# EasyEDA Pro project ProDocument_PCB_2024-01-04.epro

# Board PCB
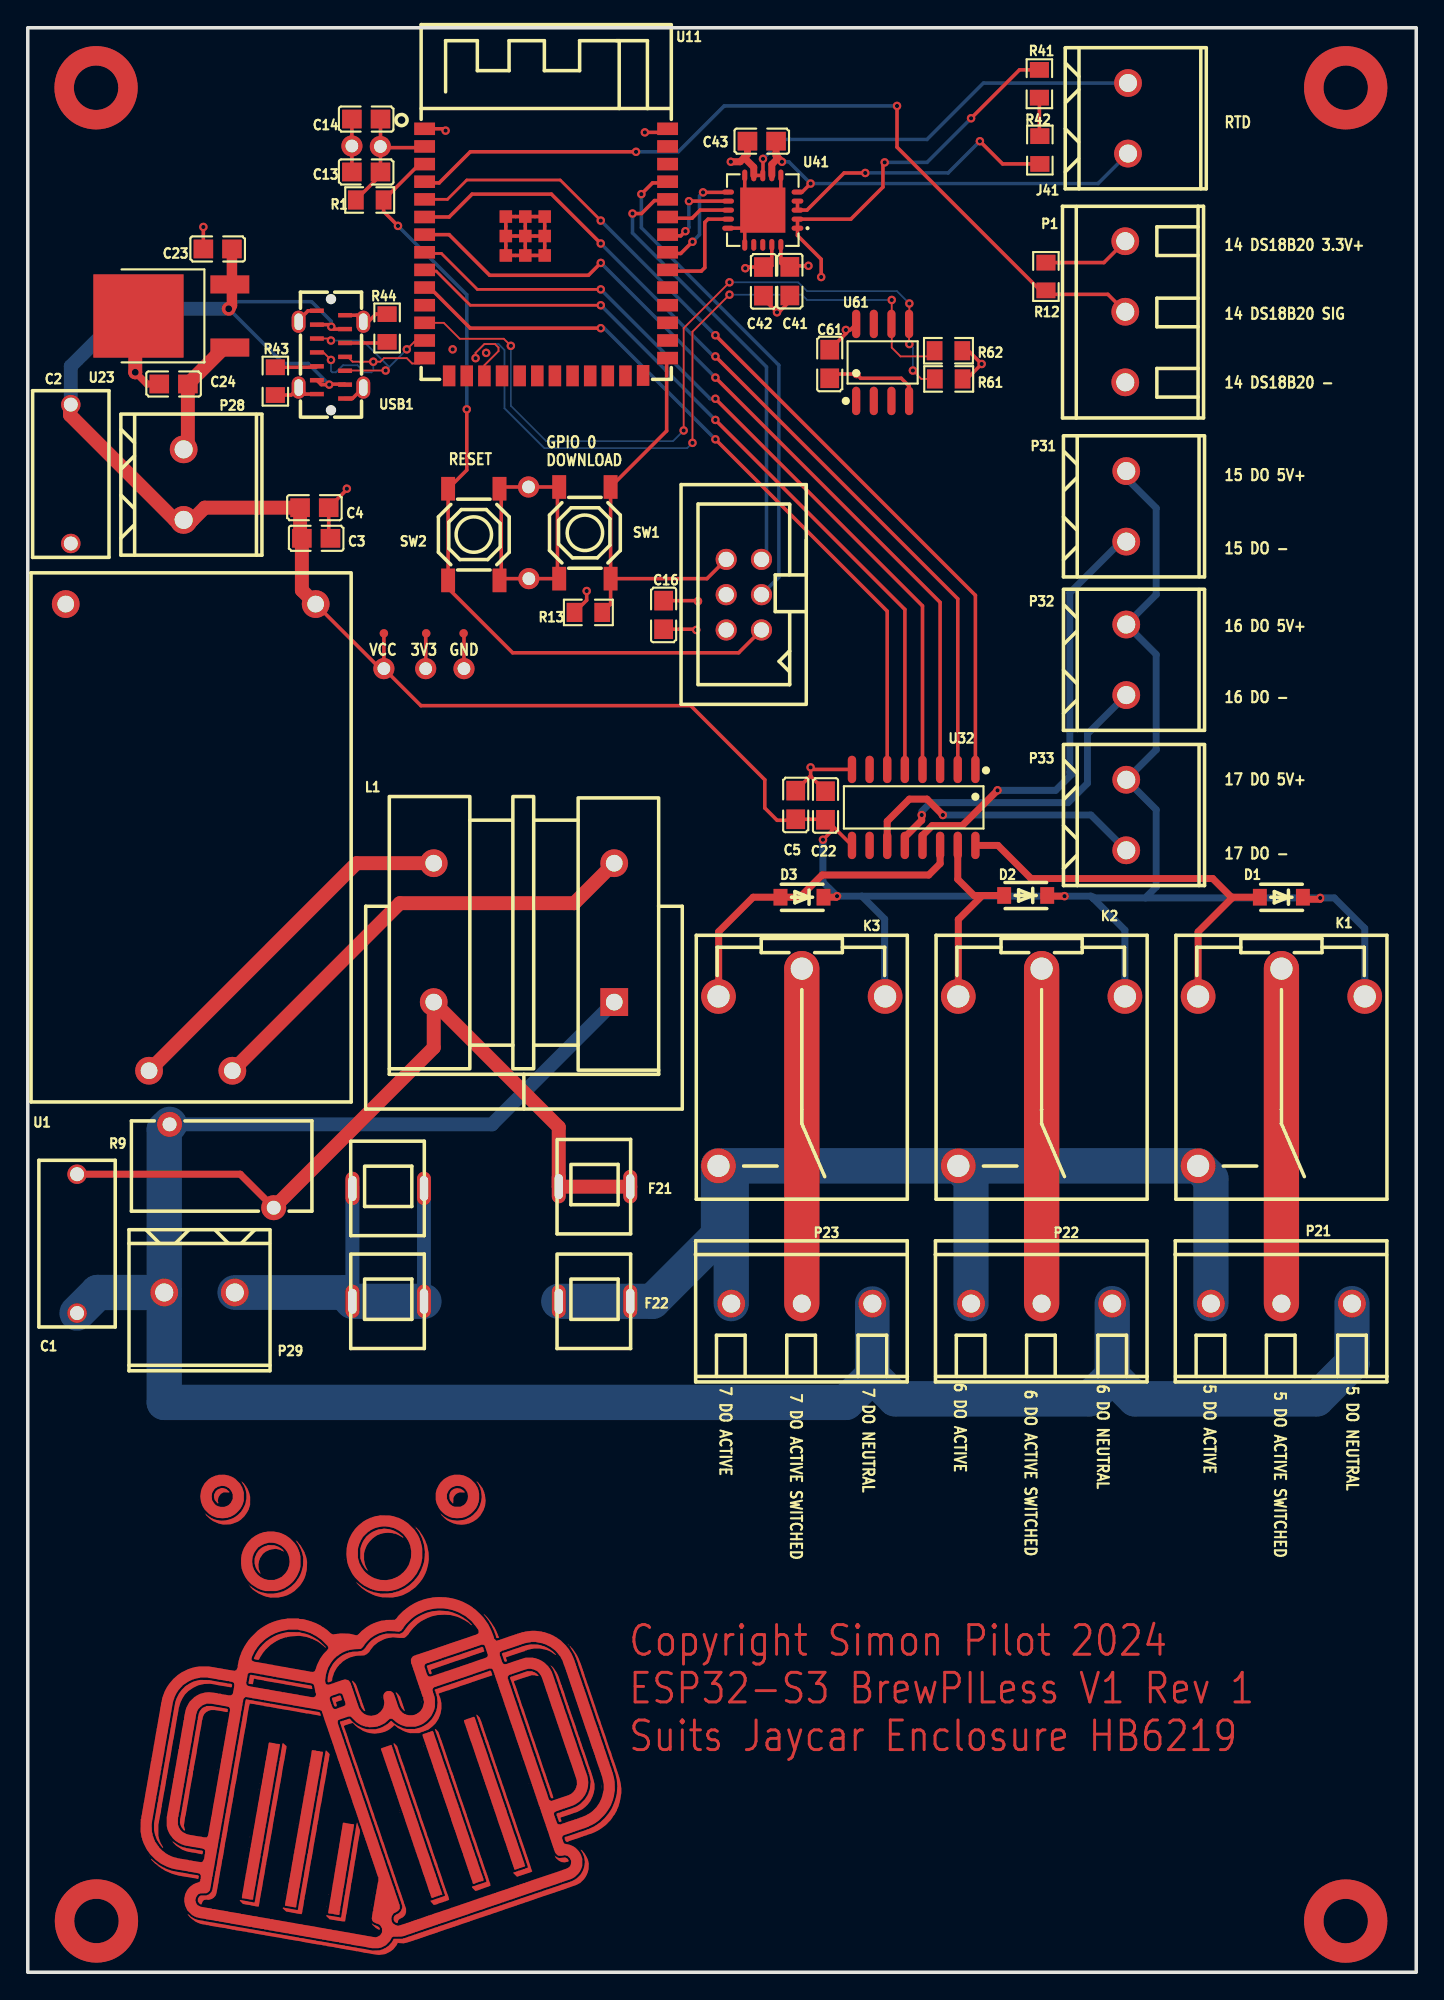
[diagram p0: board, top side]
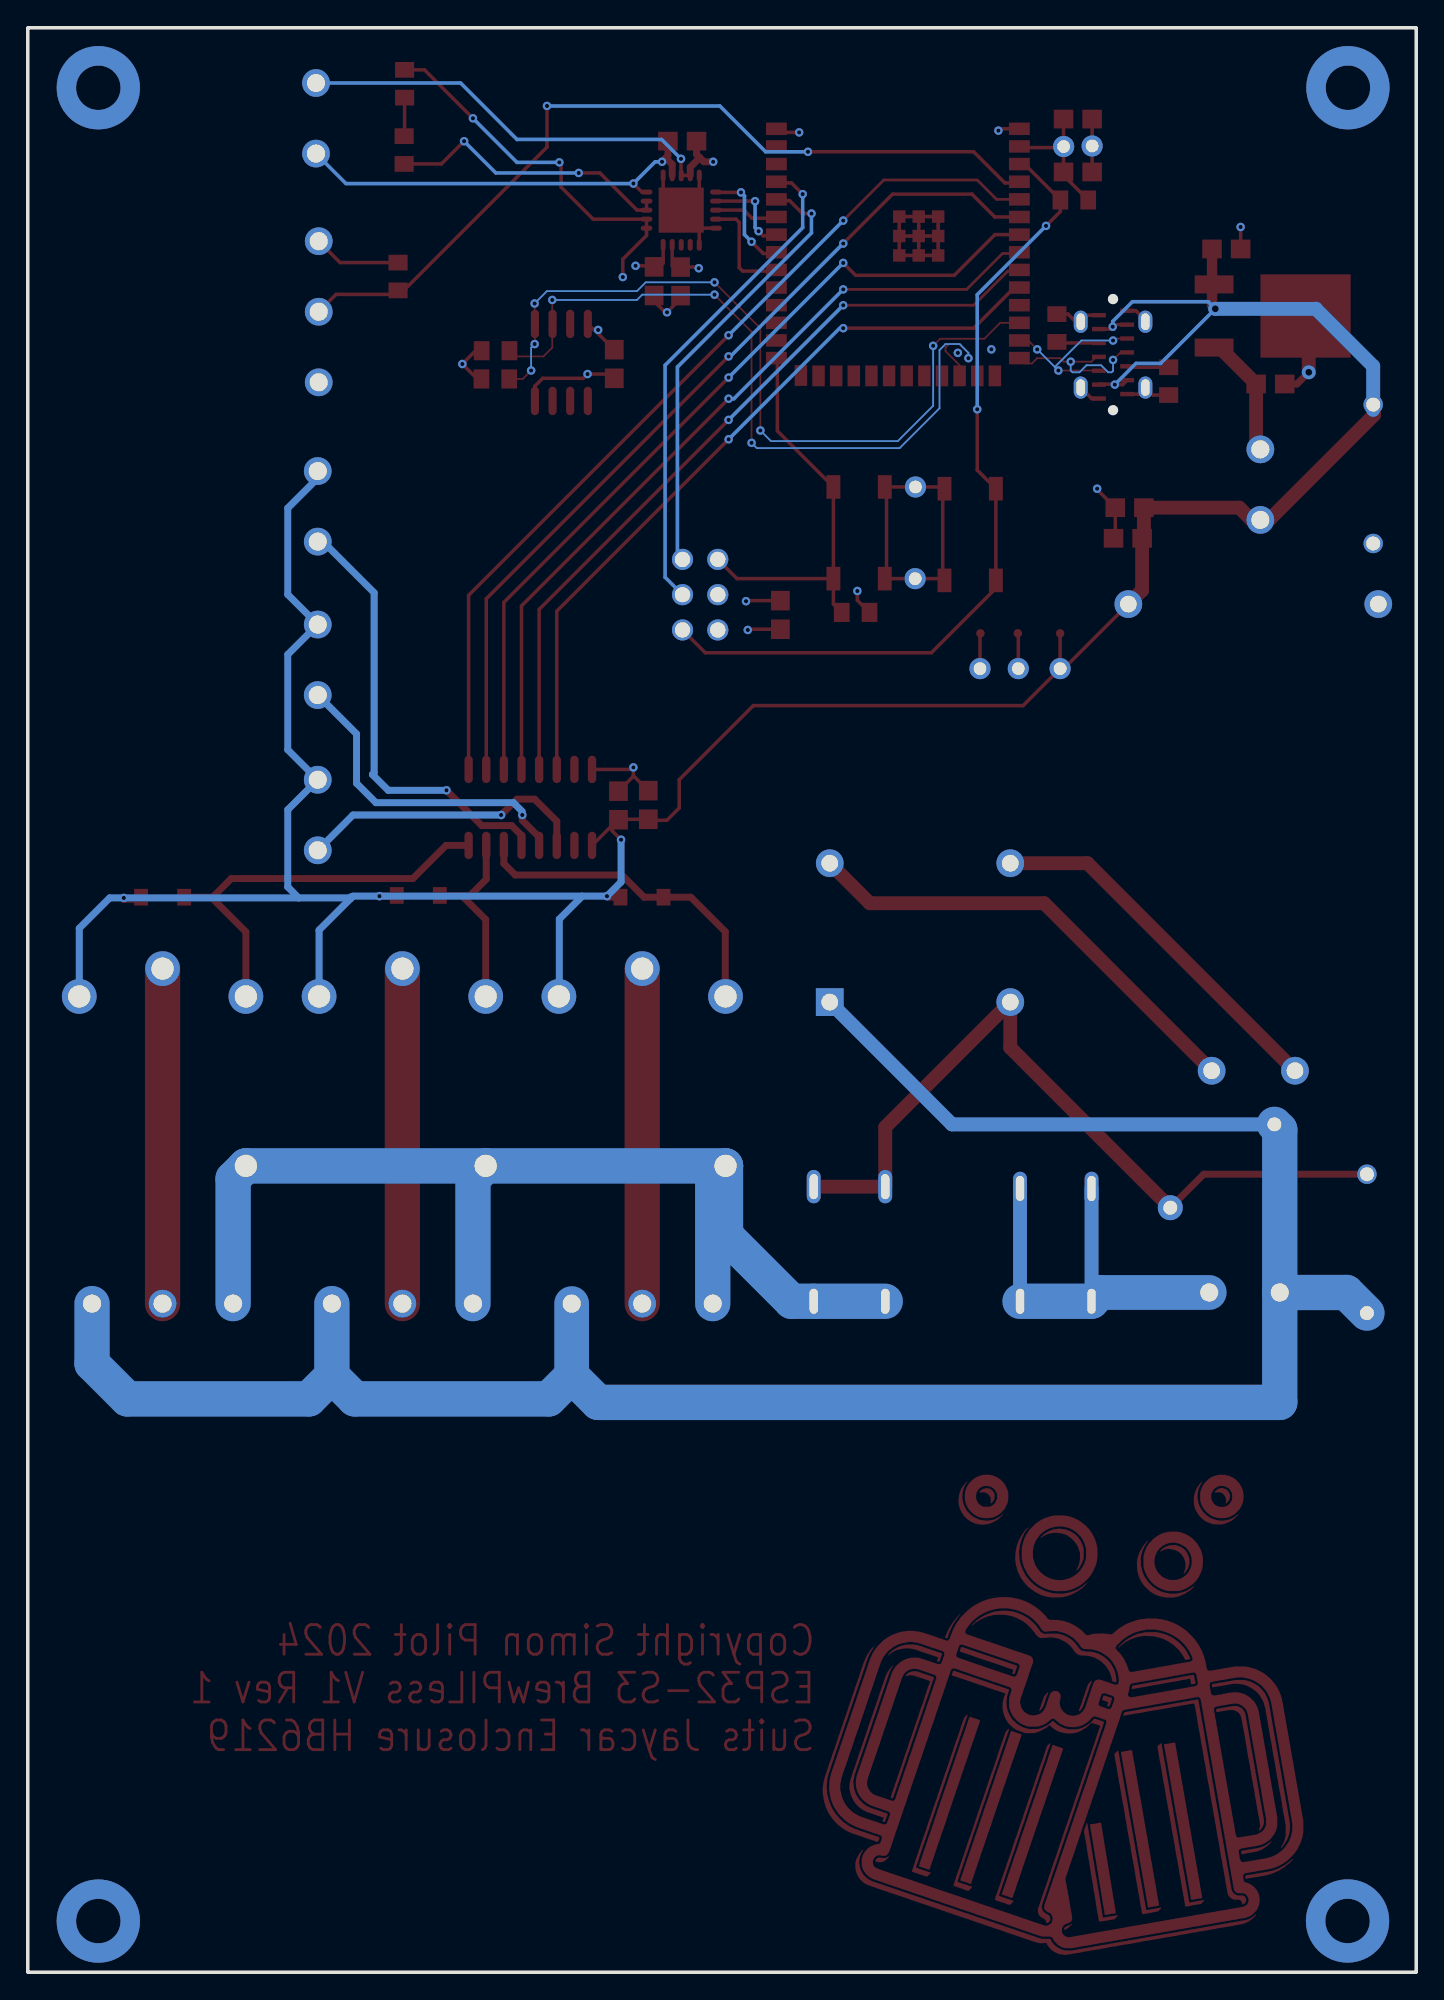
[diagram p1: board, bottom side, seen from below]

Outline 100 x 140 mm; copper layers: Top Layer, GND, 3V3, Bottom Layer. Coordinates in mm from the lower left corner of the outline.
Outline path: rectangle 100,140 0,0
Stack: Top Layer 0.035mm 外层铜厚1oz / Dielectric1 0.2104mm 7628 RC49% 8.6mil / GND 0.0152mm 内层铜厚 / Dielectric2 1.065mm 1.1mm H/HOZ 含铜 / 3V3 0.0152mm 内层铜厚 / Dielectric3 0.2104mm 7628 RC49% 8.6mil / Bottom Layer 0.035mm 外层铜厚1oz

## Design rules (mm)
net U27_USBD+: DP1
net U27_USBD-: DP1
net U11_IO39: U11_SPI
net U11_IO40: U11_SPI
net U11_IO8: U11_I2C
net U11_IO9: U11_I2C
template: User Custom Config
spacing safeClearance (default): track to track 0.152, other pairs 0.152 to 0.3
track width trackWidth (default): min 0.127, default 0.254, max 2.54
differential pair differentialPair (default): width min 0.127, default 0.254, max 2.54; gap min 0.152, default 0.152
via viaSize (default): diameter min 0.5, default 0.61, max 10; hole min 0.3, default 0.305, max 5.999
net VCC uses innerPlane1

## Placement (name value [footprint] x y rotation side)
C1  100nF  [CAP-TH_L12.0-W5.5-P10.00-D0.6]  3.55 52.46 90 top
C2  100nF  [CAP-TH_L12.0-W5.5-P10.00-D0.6]  3.1 107.87 90 top
C3  1uF  [C0805]  20.77 103.24 180 top
C4  10uF  [C0805]  20.64 105.45 180 top
C5  22uF  [C0805]  55.31 84.04 90 top
C13  100nF  [C0805]  24.37 129.62 180 top
C14  22uF  [C0805]  24.37 133.43 0 top
C16  100nF  [C0805]  45.79 97.73 90 top
C22  100nF  [C0805]  57.45 84.01 90 top
C23  10uF  [C0805]  13.68 124.07 0 top
C24  10uF  [C0805]  10.5 114.35 180 top
C41  100nF  [C0805]  54.89 121.76 90 top
C42  100nF  [C0805]  52.98 121.74 90 top
C43  100nF  [C0805]  52.86 131.84 0 top
C61  100nF  [C0805]  57.76 115.79 90 top
D1  SM4007PL  [SOD-123F_L2.8-W1.8-LS3.7-RD]  90.29 77.4 180 top
D2  SM4007PL  [SOD-123F_L2.8-W1.8-LS3.7-RD]  71.87 77.53 180 top
D3  SM4007PL  [SOD-123F_L2.8-W1.8-LS3.7-RD]  55.76 77.4 180 top
F21  -  [FUSE-TH_5X20RHOSFUSECLIP-SEAT]  40.82 56.56 0 top
F22  5A  [FUSE-TH_5X20RHOSFUSECLIP-SEAT]  40.82 48.31 0 top
F210  1A  [FUSE-TH_5X20RHOSFUSECLIP-SEAT]  25.96 56.43 0 top
F220  10A  [FUSE-TH_5X20RHOSFUSECLIP-SEAT]  25.96 48.31 0 top
J5  PROG  [IDC-TH_6P-P2.54_C11214]  51.57 99.18 90 top
J41  WJ500V-5.08-2P  [CONN-TH_2P-P5.00_WJ500V-5.08-2P]  79.24 133.48 270 top
K1  -  [RELAY-TH_973-XXVDC-SL-A]  90.29 65.16 270 top
K2  -  [RELAY-TH_973-XXVDC-SL-A]  73.02 65.16 270 top
K3  -  [RELAY-TH_973-XXVDC-SL-A]  55.75 65.16 270 top
L1  -  [FILTER-TH_UU10.5Y-10MH]  35.74 74.85 0 top
NOREF  -  [Pad_e4629]  25.65 93.86 0 top
NOREF#2  -  [Pad_e4638]  28.66 93.86 0 top
NOREF#3  -  [Pad_e4712]  28.7 96.4 0 top
NOREF#4  -  [Pad_e4713]  31.39 96.4 0 top
NOREF#5  -  [Pad_e1184]  36.09 100.34 0 top
NOREF#6  -  [Pad_e1270]  25.39 131.45 0 top
NOREF#7  -  [Pad_e1266]  23.34 131.49 0 top
NOREF#8  -  [Pad_e1180]  36.07 106.94 0 top
NOREF#9  -  [Pad_e4640]  31.42 93.86 0 top
NOREF#10  -  [Pad_e4711]  25.65 96.4 0 top
P1  WJ500V-5.08-3P  [CONN-TH_3P-P5.00_WJ500V-5.08-3P]  79.05 119.55 270 top
P21  WJ500V-5.08-3P  [CONN-TH_3P-P5.00_WJ500V-5.08-3P]  90.29 48.14 180 top
P22  WJ500V-5.08-3P  [CONN-TH_3P-P5.00_WJ500V-5.08-3P]  73.02 48.14 180 top
P23  WJ500V-5.08-3P  [CONN-TH_3P-P5.00_WJ500V-5.08-3P]  55.75 48.14 180 top
P28  WJ500V-5.08-2P  [CONN-TH_2P-P5.00_WJ500V-5.08-2P]  11.23 107.11 270 top
P29  WJ500V-5.08-2P  [CONN-TH_2P-P5.00_WJ500V-5.08-2P]  12.37 48.94 180 top
P31  WJ500V-5.08-2P  [CONN-TH_2P-P5.00_WJ500V-5.08-2P]  79.11 105.54 270 top
P32  WJ500V-5.08-2P  [CONN-TH_2P-P5.00_WJ500V-5.08-2P]  79.11 94.49 270 top
P33  WJ500V-5.08-2P  [CONN-TH_2P-P5.00_WJ500V-5.08-2P]  79.11 83.32 270 top
R1  12kΩ  [R0805]  24.63 127.6 180 top
R9  10D561K  [RES-TH_L13.0-W6.0-P7.50-D0.9-S6.00]  13.96 58.05 0 top
R12  4.7kΩ  [R0805]  73.33 122.09 270 top
R13  12kΩ  [R0805]  40.37 97.91 180 top
R41  200Ω  [R0805]  72.86 135.97 270 top
R42  200Ω  [R0805]  72.89 131.2 90 top
R43  56kΩ  [R0805]  17.83 114.56 90 top
R44  56kΩ  [R0805]  25.88 118.38 90 top
R61  2.4kΩ  [R0805]  66.33 114.72 0 top
R62  2.4kΩ  [R0805]  66.31 116.75 0 top
SW1  TS-1187A-B-A-B  [SW-SMD_4P-L5.1-W5.1-P3.70-LS6.5-TL-2]  40.13 103.64 270 top
SW2  TS-1187A-B-A-B  [SW-SMD_4P-L5.1-W5.1-P3.70-LS6.5-TL-2]  32.12 103.51 90 top
U1  -  [PWRM-TH_HLK-5M05]  11.73 81.71 90 top
U11  2.4GHz  [WIRELM-SMD_ESP32-S3-WROOM-1]  37.33 123.83 0 top
U23  -  [TO-252-2_L6.6-W6.1-P4.57-LS9.9-TL-CW]  11.26 119.25 180 top
U32  -  [SOIC-16_L9.9-W3.9-P1.27-LS6.0-BL]  63.8 83.87 180 top
U41  MAX31865ATP+T  [QFN-20_L5.0-W5.0-P0.65-BL-EP]  52.94 126.87 90 top
U61  ATECC608A-SSHDA-T  [SOIC-8_L4.9-W3.9-P1.27-LS6.0-BL]  61.57 115.9 0 top
USB1  TYPE-C 14P LTH10.0  [TYPE-C-SMD_918-468K2029Y50001]  21.84 116.47 0 top

## Footprints (pads in the part's own frame, mm; a bottom-side part is the same pattern mirrored in y, then rotated)
C0805
  rect 1.41x1.35 smd: 1(-1.03,0) 2(1.03,0)
CAP-TH_L12.0-W5.5-P10.00-D0.6
  round 1.4 hole 1: 1(-5,0) 2(5,0)
CONN-TH_2P-P5.00_WJ500V-5.08-2P
  round 2 hole 1.3: 1(-2.54,0) 2(2.54,0)
CONN-TH_3P-P5.00_WJ500V-5.08-3P
  round 2 hole 1.3: 1(-5.08,0) 2(0,0) 3(5.08,0)
FILTER-TH_UU10.5Y-10MH
  rect 2x2 hole 1.2: 1(6.5,-5)
  round 2 hole 1.2: 2(6.5,5) 3(-6.5,5) 4(-6.5,-5)
FUSE-TH_5X20RHOSFUSECLIP-SEAT
  oval 1x2.4 hole 0.6x1.8: 1(-2.575,0)
  oval 1x2.4 hole 0.6x1.799: 1(2.575,0)
IDC-TH_6P-P2.54_C11214
  round 1.524 hole 1.1: 1(-2.54,-1.27) 2(-2.54,1.27) 3(0,-1.27) 4(0,1.27) 5(2.54,-1.27) 6(2.54,1.27)
Pad_e1180
  round 1.524 hole 0.914: 42(0,0)
Pad_e1184
  round 1.524 hole 0.914: 43(0,0)
Pad_e1266
  round 1.524 hole 0.914: 44(0,0)
Pad_e1270
  round 1.524 hole 0.914: 45(0,0)
Pad_e4629
  round 1.524 hole 0.914: 1(0,0)
Pad_e4638
  round 1.524 hole 0.914: 1(0,0)
Pad_e4640
  round 1.524 hole 0.914: 1(0,0)
Pad_e4711
  round 0.61 smd: TP1(0,0)
Pad_e4712
  round 0.61 smd: TP2(0,0)
Pad_e4713
  round 0.61 smd: TP3(0,0)
PWRM-TH_HLK-5M05
  round 2 hole 1.2: 1(-16.8,3) 2(-16.8,-3) 3(16.8,9) 4(16.8,-9)
QFN-20_L5.0-W5.0-P0.65-BL-EP
  oval 0.364x0.847 smd: 1(-1.3,-2.498) 2(-0.65,-2.498) 3(0,-2.498) 4(0.65,-2.498) 5(1.3,-2.498) 11(1.3,2.498) 12(0.65,2.498) 13(0,2.498) 14(-0.65,2.498) 15(-1.3,2.498)
  oval 0.847x0.364 smd: 6(2.498,-1.3) 7(2.498,-0.65) 8(2.498,0) 9(2.498,0.65) 10(2.498,1.3) 16(-2.498,1.3) 17(-2.498,0.65) 18(-2.498,0) 19(-2.498,-0.65) 20(-2.498,-1.3)
  rect 3.25x3.25 smd: 21(0,0)
R0805
  rect 1.133x1.377 smd: 1(-1,0) 2(1,0)
RELAY-TH_973-XXVDC-SL-A
  round 2.5 hole 1.6: 1(-5.1,-6) 2(7.1,-6) 4(-5.1,6) 5(-7.1,0)
RES-TH_L13.0-W6.0-P7.50-D0.9-S6.00
  round 1.8 hole 1: 1(-3.75,3) 2(3.75,-3)
SOD-123F_L2.8-W1.8-LS3.7-RD
  rect 1x1.2 smd: 1(-1.55,0) 2(1.55,0)
SOIC-8_L4.9-W3.9-P1.27-LS6.0-BL
  oval 0.588x2.045 smd: 1(-1.905,-2.772) 2(-0.635,-2.772) 3(0.635,-2.772) 4(1.905,-2.772) 5(1.905,2.772) 6(0.635,2.772) 7(-0.635,2.772) 8(-1.905,2.772)
SOIC-16_L9.9-W3.9-P1.27-LS6.0-BL
  oval 0.602x1.971 smd: 1(-4.445,-2.736) 2(-3.175,-2.736) 3(-1.905,-2.736) 4(-0.635,-2.736) 5(0.635,-2.736) 6(1.905,-2.736) 7(3.175,-2.736) 8(4.445,-2.736) 9(4.445,2.736) 10(3.175,2.736) 11(1.905,2.736) 12(0.635,2.736) 13(-0.635,2.736) 14(-1.905,2.736) 15(-3.175,2.736) 16(-4.445,2.736)
SW-SMD_4P-L5.1-W5.1-P3.70-LS6.5-TL-2
  rect 1.7x1 smd: 1(-3.3,1.85) 2(3.3,1.85) 3(-3.3,-1.85) 4(3.3,-1.85)
TO-252-2_L6.6-W6.1-P4.57-LS9.9-TL-CW
  rect 2.8x1.3 smd: 1(-3.292,2.273) 3(-3.292,-2.273)
  rect 6.5x6 smd: 2(3.292,0)
TYPE-C-SMD_918-468K2029Y50001
  oval 1x1.6 hole 0.6x1.2: 15(-2.33,2.37) 15(-2.33,-2.37) 15(2.33,2.37) 15(2.33,-2.37)
  rect 1x0.32 smd: A1(1.016,2.84) A4(1.016,1.84) A5(1.016,0.84) A6(1.016,-0.16) A7(1.016,-1.16) A9(1.016,-2.16) A12(1.016,-3.16) B1(-1.016,-2.84) B4(-1.016,-1.84) B5(-1.016,-0.84) B6(-1.016,0.16) B7(-1.016,1.16) B9(-1.016,2.16) B12(-1.016,3.16)
WIRELM-SMD_ESP32-S3-WROOM-1
  rect 1.5x0.9 smd: 1(-8.75,8.895) 2(-8.75,7.625) 3(-8.75,6.355) 4(-8.75,5.085) 5(-8.75,3.815) 6(-8.75,2.545) 7(-8.75,1.275) 8(-8.75,0.005) 9(-8.75,-1.265) 10(-8.75,-2.535) 11(-8.75,-3.805) 12(-8.75,-5.075) 13(-8.75,-6.345) 14(-8.75,-7.615) 27(8.75,-7.615) 28(8.75,-6.345) 29(8.75,-5.075) 30(8.75,-3.805) 31(8.75,-2.535) 32(8.75,-1.265) 33(8.75,0.005) 34(8.75,1.275) 35(8.75,2.545) 36(8.75,3.815) 37(8.75,5.085) 38(8.75,6.355) 39(8.75,7.625) 40(8.75,8.895)
  rect 0.9x1.5 smd: 15(-6.985,-8.895) 16(-5.715,-8.895) 17(-4.445,-8.895) 18(-3.175,-8.895) 19(-1.905,-8.895) 20(-0.635,-8.895) 21(0.635,-8.895) 22(1.905,-8.895) 23(3.175,-8.895) 24(4.445,-8.895) 25(5.715,-8.895) 26(6.985,-8.865)
  rect 0.9x0.9 smd: 41(-2.9,2.575) 41(-2.9,1.175) 41(-2.9,-0.225) 41(-1.5,2.575) 41(-1.5,1.175) 41(-1.5,-0.225) 41(-0.1,2.575) 41(-0.1,1.175) 41(-0.1,-0.225)

## Nets
3V3: C13.1 C14.2 C16.1 C24.2 C41.2 C42.2 C61.2 J5.2 NOREF#2.1 NOREF#3.TP2 NOREF#6.45 P1.1 R1.2 R12.1 R13.2 R61.2 R62.2 U11.2 U23.2 U41.19 U41.20 U61.8
GND: C2.1 C3.1 C4.1 C5.2 C13.2 C14.1 C16.2 C22.2 C23.1 C24.1 C41.1 C42.1 C61.1 J5.4 NOREF#4.TP3 NOREF#5.43 NOREF#7.44 NOREF#8.42 NOREF#9.1 P1.3 P28.1 R43.1 R44.2 SW1.3 SW1.4 SW2.3 SW2.4 U1.3 U11.1 U11.40 U11.41 U23.1 U32.8 U41.6 U41.10 U41.15 U41.16 U41.21 U61.4 USB1.15 USB1.A1 USB1.A12 USB1.B1 USB1.B12
VCC: C2.2 C3.2 C4.2 C5.1 C22.1 C23.2 D1.1 D2.1 D3.1 K1.4 K2.4 K3.4 NOREF.1 NOREF#10.TP1 P28.2 P31.1 P32.1 P33.1 U1.4 U23.3 U32.9 USB1.A4 USB1.A9 USB1.B4 USB1.B9
RLY1_OUT: D1.2 K1.1 U32.16
RLY2_OUT: D2.2 K2.1 U32.15
RLY3_OUT: D3.2 K3.1 U32.14
U11_EN: J5.1 R1.1 SW2.1 SW2.2 U11.3
U11_IO0: J5.6 R13.1 SW1.1 SW1.2 U11.27
U11_IO4: P1.2 R12.2 U11.4
U11_IO5: U11.5 U32.1
U11_IO6: U11.6 U32.2
U11_IO7: U11.7 U32.3
U11_IO8: R61.1 U11.12 U61.5
U11_IO9: R62.1 U11.17 U61.6
U11_IO15: U11.8 U32.4
U11_IO16: U11.9 U32.5
U11_IO17: U11.10 U32.6
U11_IO39: U11.32 U41.14
U11_IO40: U11.33 U41.11
U11_IO41: U11.34 U41.12
U11_IO42: U11.35 U41.13
U11_UART0_RX: J5.5 U11.36
U11_UART0_TX: J5.3 U11.37
U27_USBD+: U11.14 USB1.A6 USB1.B6
U27_USBD-: U11.13 USB1.A7 USB1.B7
$1N51801: R43.2 USB1.B5
$1N51840: R44.1 USB1.A5
$2N2169: K2.5 P22.2
$2N2174: C1.1 L1.1 P21.1 P22.1 P23.1 P29.2 R9.1
$2N2175: K3.5 P23.2
$2N6925: C1.2 F21.1 L1.4 R9.2
$2N7118: L1.2 U1.2
$2N7268: F210.1 F220.1 P29.1
$2N13709: L1.3 U1.1
$2N17357: K1.5 P21.2
$2N17880: F22.1 K1.2 K2.2 K3.2 P21.3 P22.3 P23.3
$3N2828: P31.2 U32.13
$3N2832: P32.2 U32.12
$3N2837: P33.2 U32.11
$5N278: R41.1 U41.1 U41.2
$5N289: R42.1 U41.3 U41.4
$5N684: R41.2 R42.2
$5N942: C43.2 J41.2 U41.5 U41.7
$5N951: C43.1 J41.1 U41.8 U41.9

Pads without a net: U11 11 15 16 18 19 20 21 22 23 24 25 26 28 29 30 31 38 39; U32 7 10; U41 17 18; U61 1 2 3 7

## Via types
v1: diameter 6, hole 3.2, Top Layer to Bottom Layer, 4 vias
v2: diameter 0.61, hole 0.305, Top Layer to Bottom Layer, 72 vias
v3: diameter 1, hole 0.5, Top Layer to Bottom Layer, 2 vias

## Routing (per net, layer and track width the routed paths; a pad name or vN(x,y) marks a point on that pad's centre or on a via; arc(x,y) is an arc through that point)
3V3: length 42.9
  Top Layer w0.254: R1.2 25.4,129.38 C13.1 25.4,131.37 25.48,131.37 ; v2(40.25,99.45) 40.25,98.78 R13.2 ; 25.48,131.37 28.51,131.37 ; 25.48,131.37 25.4,131.44 C14.2 ; NOREF#2.1 28.66,96.36 NOREF#3.TP2 ; v2(51.68,122.69) 51.76,122.77 C42.2 ; v2(48.14,96.64) 48.09,96.7 45.92,96.7 ; 54.89,122.79 54.96,122.86 v2(56.23,122.86) ; U61.8 59.23,118.24 v2(58.92,118.24) 58.92,117.99 C61.2 ; 52.98,122.26 53.59,122.87 U41.19 ; R12.1 77.51,123.09 P1.1 ; U41.20 54.24,123.05 55.01,122.28 ; 67.33,116.75 67.75,116.75 v2(68.7,115.79) 67.62,114.72 67.31,114.72
  Top Layer w0.5: C24.2 8.58,114.35 v3(7.74,115.2)
  Top Layer w1: v3(7.74,115.2) 7.74,119.02 U23.2
GND: length 99.3
  Top Layer w0.254: USB1.A12 23.38,113.31 USB1.15 ; C22.2 56.38,86.11 56.38,86.15 ; 52.98,120.2 53.27,120.2 v2(53.96,119.51) 54.09,119.51 54.79,120.22 55.01,120.22 ; 51.64,129.37 51.64,128.32 52.1,127.86 52.11,127.86 ; 19.51,118.84 19.51,118.95 20.19,119.63 20.82,119.63 ; v2(30.09,132.59) 29.96,132.73 U11.1 ; U11.41 U11.41 U11.41 ; U11.41 U11.41 U11.41 ; U11.41 U11.41 ; U61.4 63.47,114.2 62.91,114.76 59.99,114.76 v2(59.68,115.07) 58.06,115.07 C61.1 ; C3.1 21.67,103.37 21.67,105.45 22.98,106.75 v2(22.98,106.81) ; 20.82,113.63 19.98,113.63 USB1.15 18.97,113.56 R43.1 ; NOREF#9.1 31.42,96.37 NOREF#4.TP3 ; USB1.A1 23.7,119.31 24.17,118.84 24.53,118.84 25.08,119.38 25.63,119.38 ; 56.38,86.15 v2(56.38,86.75) 56.53,86.6 U32.8 ; 56.38,86.15 C5.2 ; U11.41 U11.41 U11.41 ; U11.41 U11.41 ; v2(48.27,98.71) 48.23,98.76 45.92,98.76 ; U11.41 U11.41 ; U11.41 U11.41 U11.41 ; U11.41 U11.41 ; 46.01,132.64 45.84,132.47 v2(44.44,132.47) ; U41.16 51.64,125.57 ; 51.64,125.57 50.44,125.57 ; 51.64,125.57 52.44,126.37 U41.21 ; C14.1 NOREF#7.44 C13.2 ; 53.74,127.87 54.24,128.37 54.24,129.37 ; C23.1 v2(12.65,125.66) 12.57,125.74 ; NOREF#8.42 38.02,106.94 38.15,106.81 38.15,100.21 38.02,100.34 NOREF#5.43 34.1,100.34 34.1,106.94 NOREF#8.42
  Top Layer w1: P28.1 11.53,109.65 C24.1 14.15,116.98 14.55,116.98
  vias: v1(4.92,135.68) v1(94.92,135.68) v2(30.6,116.85) v2(33.01,116.59) v2(94.92,135.68)
VCC: length 225.7
  Top Layer w0.254: NOREF.1 25.38,93.86 U1.4 ; NOREF.1 NOREF#10.TP1 ; NOREF.1 28.31,91.19 47.75,91.19 53.08,85.86 53.08,83.83 53.97,82.94 55.23,82.94 C5.1 ; 57.92,82.57 57.92,82.19 v2(57.27,81.54) ; 57.92,82.57 U32.9 ; 57.92,82.57 57.51,82.98 C22.1 57.42,83.01 C5.1 ; USB1.A9 22.82,114.34 21.75,114.34 v2(21.71,114.31) 21.14,114.31 20.82,114.63 ; 19.74,102.81 C3.2 ; C5.1 55.31,83.3 ; 20.82,118.63 21.71,118.63 22.03,118.31 USB1.A4
  Top Layer w0.5: D2.1 73.47,77.48 v2(74.67,77.48) ; D1.1 91.99,77.25 93.08,77.25 v2(93.08,77.35) ; v2(58.29,77.48) 58.21,77.4 D3.1
  Top Layer w0.75: v3(14.47,119.77) 14.71,120 C23.2
  Top Layer w1: 19.74,102.81 19.74,99.5 U1.4 ; 3.1,112.49 3.04,112.43 3.04,112.12 10.59,104.57 11.86,104.57 12.74,105.45 C4.2 19.61,103.37 C3.2
  Bottom Layer w0.254: v2(21.86,118.47) 21.86,118.85 20.44,120.28 14.98,120.28 v3(14.47,119.77) 18.41,115.83 20.19,115.83 v2(21.71,114.31)
  Bottom Layer w0.5: P31.1 79.11,107.58 81.27,105.42 81.27,99.19 P32.1 81.27,94.88 81.27,88.02 P33.1 81.27,83.7 81.27,78.14 80.48,77.35 ; K2.4 79.02,75.03 76.7,77.35 80.48,77.35 ; 80.48,77.35 v2(93.08,77.35) 94.1,77.35 96.29,75.16 K1.4 ; 76.77,77.41 76.58,77.48 v2(74.67,77.48) 60.07,77.48 ; 60.07,77.48 61.72,75.83 61.72,70.29 K3.4 ; 60.07,77.48 v2(58.29,77.48) 57.27,78.49 v2(57.27,81.54)
  Bottom Layer w1: v3(14.47,119.77) 7.23,119.77 3.1,115.63 3.1,112.49
(no net):
  vias: v1(4.95,3.69) v1(94.92,3.68)
RLY1_OUT: length 30.2
  Top Layer w0.5: 86.73,77.35 84.29,74.91 K1.1 ; 86.73,77.35 86.79,77.4 D1.2 ; 86.73,77.35 85.34,78.75 72.26,78.75 69.87,81.13 U32.16
RLY2_OUT: length 14.3
  Top Layer w0.5: K2.1 67.02,75.79 68.75,77.53 ; 68.75,77.53 68.14,77.53 66.98,78.69 U32.15 ; 68.75,77.53 D2.2
RLY3_OUT: length 24.3
  Top Layer w0.5: 49.76,69.93 49.76,74.92 52.24,77.4 D3.2 55.61,77.4 57.21,79 64.89,79 65.71,79.82 U32.14
U11_EN: length 60.1
  Top Layer w0.254: 28.51,130.1 28.12,130.1 R1.1 25.63,126.77 v2(26.66,125.74) ; J5.1 51.2,95 34.92,95 30.28,99.65 SW2.1 SW2.2 31.62,108.15 v2(31.62,112.53)
  Bottom Layer w0.254: v2(26.66,125.74) 31.62,120.78 v2(31.62,112.53)
U11_IO0: length 29
  Top Layer w0.254: R13.1 41.98,98.51 SW1.2 ; SW1.2 SW1.1 46.01,110.97 46.01,116.13 ; SW1.2 48.92,100.34 J5.6
U11_IO4: length 60.7
  Top Layer w0.254: 28.51,128.83 29.63,128.83 31.87,131.07 v2(43.81,131.07) ; v2(62.61,134.37) 62.61,131.41 73.2,120.81 77.79,120.81 P1.2
  Bottom Layer w0.254: v2(62.61,134.37) 50.16,134.37 46.86,131.07 v2(43.81,131.07)
U11_IO5: length 65.2
  Top Layer w0.2: v2(41.27,126.12) 38.35,129.04 31.62,129.04 30.22,127.65 U11.5
  Top Layer w0.254: v2(49.52,117.86) 68.25,99.14 U32.1
  Bottom Layer w0.254: v2(49.52,117.86) v2(41.27,126.12)
U11_IO6: length 63.4
  Top Layer w0.254: U32.2 66.98,98.88 v2(49.52,116.34) ; v2(41.27,124.47) 37.71,128.02 32,128.02 30.35,126.38 U11.6
  Bottom Layer w0.254: v2(41.27,124.47) 49.4,116.34 v2(49.52,116.34)
U11_IO7: length 60.9
  Top Layer w0.254: U32.3 65.71,98.63 v2(49.52,114.81) ; U11.7 30.34,125.11 33.27,122.18 40.38,122.18 v2(41.27,123.07)
  Bottom Layer w0.254: v2(41.27,123.07) v2(49.52,114.81)
U11_IO8: length 57.4
  Top Layer w0.127: v2(34.79,117.1) 34.28,117.61 31.11,117.61 29.96,118.76 U11.12 ; v2(63.49,120.15) 63.49,118.7 U61.5 63.47,117.25 v2(63.49,117.23) ; R61.1 64.35,114.72 v2(63.75,115.32) ; v2(50.54,121.67) 47.24,118.37 v2(47.24,111)
  Bottom Layer w0.127: v2(50.54,121.67) 55.49,121.67 56.13,121.04 62.61,121.04 v2(63.49,120.15) ; v2(47.24,111) 46.47,110.24 37.34,110.24 34.79,112.78 v2(34.79,117.1) ; v2(63.49,117.23) 63.75,116.97 v2(63.75,115.32)
U11_IO9: length 57.4
  Top Layer w0.127: v2(47.87,110.12) 47.87,118.12 v2(50.54,120.78) ; v2(32.25,116.21) 32.25,116.59 32.89,117.23 33.65,117.23 33.9,116.97 33.9,116.72 32.89,115.7 U11.17 ; R62.1 64.9,116.34 62.86,116.34 62.22,116.97 62.22,118.66 U61.6 62.22,118.7 v2(62.22,120.4)
  Bottom Layer w0.127: v2(32.25,116.21) 32.25,116.59 32.89,117.23 33.9,117.23 34.33,116.8 34.33,112.61 37.2,109.73 47.49,109.73 v2(47.87,110.12) ; v2(62.22,120.4) 56.13,120.4 55.75,120.78 v2(50.54,120.78)
U11_IO15: length 58.2
  Top Layer w0.2: v2(41.27,121.16) 32.38,121.16 29.79,123.75 28.51,123.75
  Top Layer w0.254: v2(49.52,113.29) 64.44,98.37 U32.4
  Bottom Layer w0.254: v2(41.27,121.16) 49.14,113.29 v2(49.52,113.29)
U11_IO16: length 56.3
  Top Layer w0.2: v2(41.27,120.02) 31.87,120.02 29.41,122.48 28.51,122.48
  Top Layer w0.254: v2(49.52,111.77) 63.17,98.12 U32.5
  Bottom Layer w0.254: v2(41.27,120.02) v2(49.52,111.77)
U11_IO17: length 54.4
  Top Layer w0.254: U32.6 61.9,97.99 v2(49.52,110.37) ; 28.51,121.21 29.03,121.21 31.87,118.37 v2(41.27,118.37)
  Bottom Layer w0.254: v2(41.27,118.37) 41.52,118.37 v2(49.52,110.37)
U11_IO39: length 7.9
  Top Layer w0.254: U41.14 48.99,126.22 48.76,125.99 48.76,122.73 48.51,122.48 46.01,122.48
U11_IO40: length 7.9
  Top Layer w0.254: 46.01,123.75 47.03,123.75 v2(47.87,124.59) ; U41.11 50.42,128.15 v2(48.64,128.15)
  Bottom Layer w0.254: v2(48.64,128.15) 48.38,127.9 48.38,125.1 v2(47.87,124.59)
U11_IO41: length 6.6
  Top Layer w0.254: v2(47.36,125.36) 47.03,125.02 46.01,125.02 ; U41.12 47.63,127.52 v2(47.62,127.51)
  Bottom Layer w0.254: v2(47.36,125.36) 47.62,125.61 v2(47.62,127.51)
U11_IO42: length 4.7
  Top Layer w0.254: 46.01,126.29 47.84,126.29 48.42,126.87 U41.13
U11_UART0_RX: length 31.9
  Top Layer w0.254: v2(43.55,126.63) 44.2,126.63 45.14,127.56 46.01,127.56
  Bottom Layer w0.254: v2(43.55,126.63) 43.55,125.23 53.21,115.58 53.21,102.09 J5.5
U11_UART0_TX: length 35.6
  Top Layer w0.254: 46.01,128.83 45,128.83 v2(44.19,128.02)
  Bottom Layer w0.254: v2(44.19,128.02) 44.19,125.61 54.1,115.7 54.1,100.44 J5.3
U27_USBD+: length 12.6
  Top Layer w0.127: v2(21.84,116.08) 21.29,116.63 20.83,116.63 20.82,116.63 ; U11.14 28.2,115.83 27.68,115.83 27.3,116.21 25.65,116.21 25.39,115.96 v2(24.89,115.96) 23.39,115.96 22.98,116.37 22.92,116.37 USB1.A6
  Bottom Layer w0.127: v2(24.89,115.96) 24.89,115.32 24.76,115.2 24.25,115.2 23.74,115.7 22.7,115.7 22.19,115.2 21.94,115.2 21.84,115.29 v2(21.84,116.08)
U27_USBD-: length 12.6
  Top Layer w0.127: 20.82,117.63 21.69,117.63 v2(21.84,117.48) ; 28.51,117.4 27.85,117.4 v2(27.3,116.85) ; v2(25.78,115.32) 23.23,115.32 23.21,115.31 USB1.A7
  Bottom Layer w0.127: 26.03,115.58 24.12,117.48 v2(21.84,117.48) ; 26.03,115.58 v2(27.3,116.85) ; 26.03,115.58 v2(25.78,115.32)
$1N51801: length 3
  Top Layer w0.254: 20.82,115.63 20.75,115.56 R43.2
$1N51840: length 2.8
  Top Layer w0.254: 25.63,117.38 25.55,117.31 USB1.A5
$2N2169: length 24.1
  Top Layer w2.54: P22.2 K2.5
$2N2174: length 166.9
  Bottom Layer w1: L1.1 33.43,61.05 R9.1
  Bottom Layer w2.5: 60.83,42.93 P23.1
  Bottom Layer w2.54: P29.2 9.83,60.66 R9.1 ; P29.2 9.83,41.03 58.92,41.03 60.83,42.93 62.48,41.28 76.45,41.28 78.1,42.93 ; P29.2 5.03,48.94 C1.1 ; P21.1 95.37,43.82 92.83,41.28 79.75,41.28 78.1,42.93 ; 78.1,42.93 P22.1
$2N2175: length 24.1
  Top Layer w2.54: K3.5 P23.2
$2N6925: length 56.9
  Top Layer w0.5: C1.2 15.3,57.46 R9.2
  Top Layer w1: F21.1 F21.1 38.24,60.84 29.24,69.85 29.24,66.57 R9.2
$2N7118: length 33.7
  Top Layer w1: L1.2 39.36,76.97 26.8,76.97 U1.2
$2N7268: length 30.1
  Bottom Layer w1: F220.1 F210.1 ; F220.1 F210.1
  Bottom Layer w2.5: P29.1 22.75,48.94 F220.1
  Bottom Layer w2.54: F220.1 F220.1
$2N13709: length 26.7
  Top Layer w1: 29.24,79.85 23.68,79.85 U1.1
$2N17357: length 24.1
  Top Layer w2.54: K1.5 P21.2
$2N17880: length 83.9
  Bottom Layer w2.54: K3.2 K2.2 ; K3.2 49.75,53.06 44.99,48.31 F22.1 F22.1 ; K3.2 50.67,57.14 P23.3 ; K2.2 67.94,57.14 P22.3 ; K2.2 K1.2 85.21,57.14 P21.3
$3N2828: length 32
  Top Layer w0.5: v2(69.84,85.1) 67.3,82.56 65.14,82.56 64.44,81.85 U32.13
  Bottom Layer w0.5: v2(69.84,85.1) 74.04,85.1 75.18,86.24 75.05,86.37 75.05,99.32 78.73,103 79.11,103
$3N2832: length 23
  Top Layer w0.5: v2(64.38,83.32) 64.38,82.94 63.17,81.72 U32.12
  Bottom Layer w0.5: P32.2 76.32,89.16 76.32,85.6 74.92,84.21 65.02,84.21 64.38,83.57
$3N2837: length 21.1
  Top Layer w0.5: U32.11 61.9,82.87 63.49,84.46 64.76,84.46 v2(65.91,83.32)
  Bottom Layer w0.5: v2(65.91,83.32) 76.58,83.32 P33.2
$5N278: length 27.7
  Top Layer w0.254: v2(67.94,133.48) 71.43,136.97 R41.1 ; v2(61.72,130.31) 61.59,130.18 61.59,128.53 59.28,126.22 U41.2 55.44,125.04 57.14,123.34 v2(57.14,122.05)
  Bottom Layer w0.254: v2(61.72,130.31) 64.76,130.31 v2(67.94,133.48)
$5N289: length 20.8
  Top Layer w0.254: U41.4 U41.3 56.12,126.87 58.8,129.55 v2(60.32,129.55) ; v2(68.57,131.83) 70.21,130.2 R42.1
  Bottom Layer w0.25: v2(60.32,129.55) 66.29,129.55 v2(68.57,131.83)
$5N684: length 2.8
  Top Layer w0.254: R41.2 72.86,132.23 R42.2
$5N942: length 30.8
  Top Layer w0.254: v2(56.38,128.78) 55.77,128.17 U41.5
  Top Layer w0.5: v2(54.32,130.35) 54.04,130.63 ; 54.04,130.63 53.59,130.17 53.59,129.37 ; 54.04,130.63 53.89,130.78 C43.2
  Bottom Layer w0.254: v2(54.32,130.35) 54.81,130.35 v2(56.38,128.78) 77.08,128.78 J41.2
$5N951: length 34.3
  Top Layer w0.254: v2(52.95,130.56) 52.95,129.39 52.94,129.37 52.29,129.37
  Top Layer w0.5: 51.6,130.65 52.29,129.96 52.29,129.37 ; 51.6,130.65 51.3,130.35 v2(50.64,130.35) ; 51.6,130.65 51.83,130.88 C43.1
  Bottom Layer w0.254: J41.1 68.83,136.02 64.76,131.96 54.35,131.96 v2(52.95,130.56)

## Copper pours and planes (outline as drawn; the poured copper is in the pictures)
3V3 on 3V3: 0.26,139.74 99.74,139.74 99.74,83.98 0.26,83.98
GND on Top Layer: 0.11,89.18 48.36,89.18 49.78,87.76 49.78,83.84 99.99,83.84 99.82,139.83 99.94,139.96 0,139.96
GND on Bottom Layer: 0.11,89.18 48.36,89.18 49.78,87.76 49.78,83.84 99.8,83.84 99.82,139.83 99.94,139.96 0,139.96
GND on GND: 0.26,139.74 99.74,139.74 99.74,0.26 0.26,0.26
$2N2169 on Top Layer: 71.11,50.55 80.39,50.55 80.39,65.35 75.16,65.35 75.16,74.05 71.11,74.05
$2N2174 on Top Layer: -0.64,44.08 99.82,44.08 99.82,36.27 -0.64,36.27
$2N2174 on Bottom Layer: -0.64,44.08 99.82,44.08 99.82,36.27 -0.64,36.27
$2N2175 on Top Layer: 53.84,50.55 63.11,50.55 63.11,65.35 57.88,65.35 57.88,74.05 53.84,74.05
$2N7268 on Bottom Layer: 13.71,52.46 29.97,52.46 29.97,46.62 13.71,46.62
$2N17357 on Top Layer: 88.39,50.55 97.66,50.55 97.66,65.35 92.43,65.35 92.43,74.05 88.39,74.05
$2N17880 on Bottom Layer: 36.57,52.46 51.94,52.46 51.94,46.62 36.57,46.62
$2N17880 on Bottom Layer: 47.14,64.38 100,64.38 100,52.01 47.14,52.01

Small or netless copper shapes (teardrops, artwork), in the pictures only: 101 on Top Layer, 51 on GND, 15 on 3V3

## Text on the board
Top Layer: Copyright Simon Pilot 2024 / ESP32-S3 BrewPILess V1 Rev 1 / Suits Jaycar Enclosure HB6219
Top Silkscreen Layer: VCC | 3V3 | RESET | GND | GPIO 0 / DOWNLOAD | RTD | 14 DS18B20 3.3V+ | 14 DS18B20 SIG | 14 DS18B20 - | 15 DO 5V+ | 15 DO - | 16 DO 5V+ | 16 DO - | 17 DO 5V+ | 17 DO - | 7 DO ACTIVE | 7 DO ACTIVE SWITCHED | 7 DO NEUTRAL | 6 DO ACTIVE | 6 DO ACTIVE SWITCHED | 6 DO NEUTRAL | 5 DO ACTIVE | 5 DO ACTIVE SWITCHED | 5 DO NEUTRAL
